# Altium schematic sheet Power_Supply.SchDoc: Power Supply
size A4; DrawnBy: Tomáš Polišenský; DocumentNumber: 1; Revision: A; SheetNumber: 1; SheetTotal: 8; ProjectName: DykoDAC2
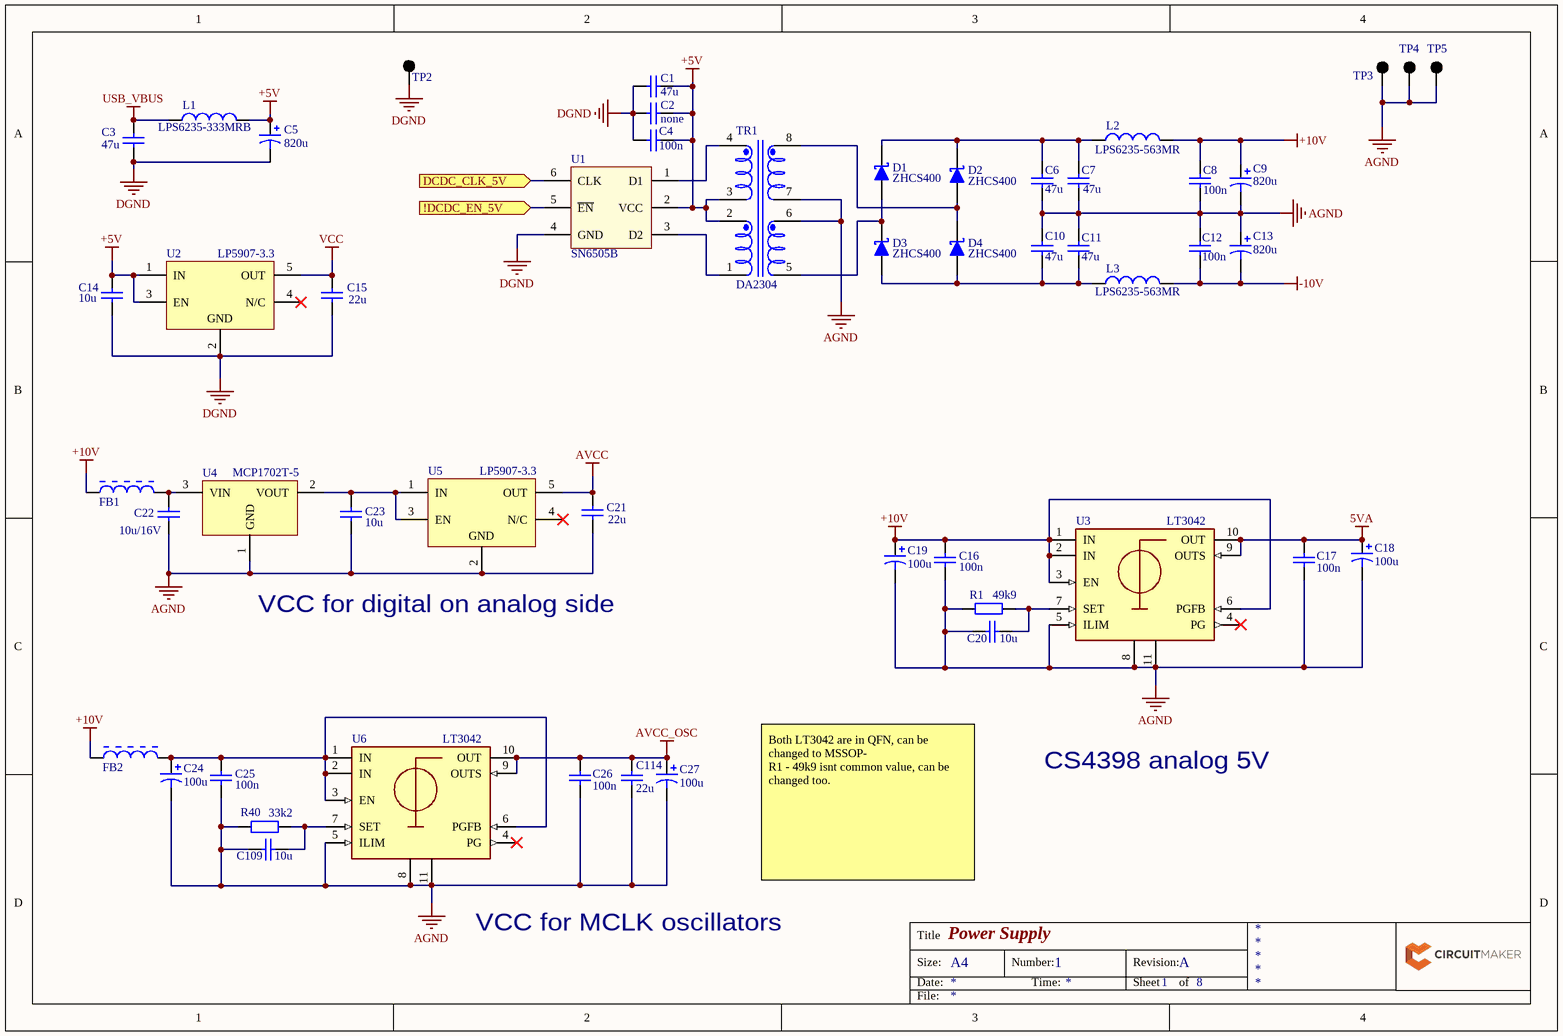
[diagram p0: Power_Supply.SchDoc]

## Parts
C1  47u  [PCB-6alau6k4isvsg1wxu4va-1]
C2  none  [PCB-6alau6k4isvsg1wxu4va-1]
C3  47u  [PCB-6alau6k4isvsg1wxu4va-1]
C4  100n  [PCB-rf0pzaa82dpbeu9l4sxm-1]
C5  820u  [A750MS827M1CAAE013]
C6  47u  [PCB-6alau6k4isvsg1wxu4va-1]
C7  47u  [PCB-6alau6k4isvsg1wxu4va-1]
C8  100n  [PCB-rf0pzaa82dpbeu9l4sxm-1]
C9  820u  [A750MS827M1CAAE013]
C10  47u  [PCB-6alau6k4isvsg1wxu4va-1]
C11  47u  [PCB-6alau6k4isvsg1wxu4va-1]
C12  100n  [PCB-rf0pzaa82dpbeu9l4sxm-1]
C13  820u  [A750MS827M1CAAE013]
C14  10u  [PCB-rf0pzaa82dpbeu9l4sxm-1]
C15  22u  [PCB-rf0pzaa82dpbeu9l4sxm-1]
C16  100n  [PCB-rf0pzaa82dpbeu9l4sxm-1]
C17  100n  [PCB-rf0pzaa82dpbeu9l4sxm-1]
C18  100u  [PCB-9bfrndi9huxo1n7cihpl-1]
C19  100u  [PCB-9bfrndi9huxo1n7cihpl-1]
C20  10u  [PCB-rf0pzaa82dpbeu9l4sxm-1]
C21  22u  [PCB-rf0pzaa82dpbeu9l4sxm-1]
C22  10u/16V  [PCB-rf0pzaa82dpbeu9l4sxm-1]
C23  10u  [PCB-rf0pzaa82dpbeu9l4sxm-1]
C24  100u  [PCB-9bfrndi9huxo1n7cihpl-1]
C25  100n  [PCB-rf0pzaa82dpbeu9l4sxm-1]
C26  100n  [PCB-rf0pzaa82dpbeu9l4sxm-1]
C27  100u  [PCB-9bfrndi9huxo1n7cihpl-1]
C109  10u  [PCB-rf0pzaa82dpbeu9l4sxm-1]
C114  22u  [PCB-rf0pzaa82dpbeu9l4sxm-1]
D1  ZHCS400  [PCB-mrclmtn06znaca5ywvvw-1]
D2  ZHCS400  [PCB-mrclmtn06znaca5ywvvw-1]
D3  ZHCS400  [PCB-mrclmtn06znaca5ywvvw-1]
D4  ZHCS400  [PCB-mrclmtn06znaca5ywvvw-1]
FB1  BLM18EG391TN1D  [MURA-BLM18-F-H3-CHIP-2_V]  (value not drawn)
FB2  BLM18EG391TN1D  [MURA-BLM18-F-H3-CHIP-2_V]  (value not drawn)
L1  LPS6235-333MRB  [LPS6235]
L2  LPS6235-563MR  [PCB-91apuy3syfgd6vk6qbo6-1]
L3  LPS6235-563MR  [PCB-91apuy3syfgd6vk6qbo6-1]
R1  49k9  [PCB-3d5y3t7f8drf35yjcj59-1]
R40  33k2  [PCB-3d5y3t7f8drf35yjcj59-1]
TP2  Keystone Electronics 5001  [P1-09]  (value not drawn)
TP3  Keystone Electronics 5001  [P1-09]  (value not drawn)
TP4  Keystone Electronics 5001  [P1-09]  (value not drawn)
TP5  Keystone Electronics 5001  [P1-09]  (value not drawn)
TR1  DA2304  [PCB-wryx25zm61bkpund2vng-1]
U1  SN6505B  [PCB-z49b8x4xdp07datjgpqp-1]
U2  LP5907-3.3  [PCB-ab03it339uw922kmt1cl-1]
U3  LT3042  [PCB-n2zh5wqg9qgt346qmob6-1]
U4  MCP1702T-5  [SOT-23A-CB3_L]
U5  LP5907-3.3  [PCB-ab03it339uw922kmt1cl-1]
U6  LT3042  [PCB-n2zh5wqg9qgt346qmob6-1]

## Ports
!DCDC_EN_5V (in), DCDC_CLK_5V (in)

## Nets
5VA: C17.2 C18.1 U3.9(OUTS) U3.10(OUT)
+5V: C1.1 C2.1 C4.2 C5.1 C14.2 L1.2 TR1.2 TR1.3 U1.2(VCC) U2.1(IN) U2.3(EN)
+10V: C8.2 C9.1 C16.2 C19.1 FB1.1 FB2.1 L2.2 U3.1(IN) U3.2(IN) U3.3(EN) U3.6(PGFB)
-10V: C12.1 C13.2 L3.2
AGND: C6.1 C7.1 C8.1 C9.2 C10.2 C11.2 C12.2 C13.1 C16.1 C17.1 C18.2 C19.2 C20.2 C21.1 C22.1 C23.1 C24.2 C25.1 C26.1 C27.2 C109.2 C114.1 R1.2 R40.2 TP3.1 TP4.1 TP5.1 TR1.6 TR1.7 U3.5(ILIM) U3.8(GND) U3.11(GND) U4.1(GND) U5.2(GND) U6.5(ILIM) U6.8(GND) U6.11(GND)
AVCC: C21.2 U5.5(OUT)
AVCC_OSC: C26.2 C27.1 C114.2 U6.9(OUTS) U6.10(OUT)
DGND: C1.2 C2.2 C3.1 C4.1 C5.2 C14.1 C15.1 TP2.1 U1.4(GND) U2.2(GND)
USB_VBUS: C3.2 L1.1
VCC: C15.2 U2.5(OUT)
!DCDC_EN_5V: U1.5(~{EN}) ; port !DCDC_EN_5V
DCDC_CLK_5V: U1.6(CLK) ; port DCDC_CLK_5V
NetC6_2: C6.2 C7.2 D1.2(K) D2.2(K) L2.1
NetC10_1: C10.1 C11.1 D3.1(A) D4.1(A) L3.1
NetC20_1: C20.1 R1.1 U3.7(SET)
NetC22_2: C22.2 FB1.2 U4.3(VIN)
NetC23_2: C23.2 U4.2(VOUT) U5.1(IN) U5.3(EN)
NetC24_1: C24.1 C25.2 FB2.2 U6.1(IN) U6.2(IN) U6.3(EN) U6.6(PGFB)
NetC109_1: C109.1 R40.1 U6.7(SET)
NetD1_1: D1.1(A) D3.2(K) TR1.5
NetD2_1: D2.1(A) D4.2(K) TR1.8
NetTR1_1: TR1.1 U1.3(D2)
NetTR1_4: TR1.4 U1.1(D1)

Not connected (* = marked no-connect by the designer): U2 4(N/C)*; U3 4(PG)*; U5 4(N/C)*; U6 4(PG)*

## Notes on the sheet
- VCC for digital on analog side
- CS4398 analog 5V
- Both LT3042 are in QFN, can be changed to MSSOP-
  R1 - 49k9 isnt common value, can be changed too.
- (near U6) VCC for MCLK oscillators
- Title
- Size:
- Date:
- A4
- Number:
- Time:
- Revision:
- Sheet
- of
- File:

## Library data of the parts
C1-C3 C6 C7 C10 C11 = CMP-a2006a3718e57dc7-1: 1210 100 uF 16 V ±20% Tolerance X5R SMT Multilayer Ceramic Capacitor; Case/Package: 1210
C4 C8 C12 = CMP-x8hddryxw4o380xfi98v-3: Generic Capacitor 0603; CustomComponentID: x8hddryxw4o380xfi98v; LCSC Part #: C14663
C5 C9 C13 = CMP-1544d833d83eca83-8: Cap Aluminum Polymer 1000uF 16VDC 20% (10 X 12mm) Radial 5mm 0.013 Ohm 5250mA 2000h 105C Bag; Voltage Rating (DC): 16.0 V; Capacitance: 1.00 mF
C14-C17 C20-C23 C25 C26 C109 C114 = CMP-x8hddryxw4o380xfi98v-1: Capacitor 0603; CustomComponentID: x8hddryxw4o380xfi98v
  C14: LCSC Part #: C19702; LCSC Part #: C25804
  C15 C21 C114: LCSC Part #: C59461
  C16 C17 C25 C26: LCSC Part #: C14663
  C20 C23 C109: LCSC Part #: C19702
C18 C19 C24 C27 = CMP-6546a831a81eba81-4: In a Pack of 25, KEMET 100?F Electrolytic Capacitor 10V dc Through Hole - A758EK107M1AAAE016; Capacitance: 100 µF; Equivalent Series Resistance (ESR): 16.0 m?; Voltage Rating (DC): 10.0 V; Capacitance Tolerance: ±20%; Mounting Style: Through Hole; Size-Diameter: 6.30 mm; Size-Height: 8.00 mm; Operating Temperature: 105 °C (max); RoHS: Compliant; Manufacturer Part Number: A758EK107M1AAAE016; Octopart URL: https://octopart.com/a758ek107m1aaae016-kemet-75360318; OctopartID: 6546a831a81eba81
D1-D4 = CMP-3796931-5: Schottky Rectifier, 0.4A, 40V SOD-323; Power Rating: 250 mW; REACH SVHC Compliance: No SVHC; Packaging: Cut Tape (CT); Octopart URL: https://octopart.com/zhcs400-diodes+inc.-13152663; Case/Package: SOD-323; Lifecycle Status: Active; RoHS: Compliant; OctopartID: 21c3e801b532fe04; Manufacturer Part Number: ZHCS400
FB1 FB2 = CMP-1144711-3: Chip Ferrite Bead for GHz Band General Use (Low DC Resistance Type), 390 Ohm, 500 mA, -55 to 125 degC, 1.6 x 0.8 x 0.65 mm SMD, Tape and Reel; Lead-Free Status: Lead Free; Number of Circuits: 1; Resistance: 390.0 Ω; Shielding: No; Manufacturer Part Number: BLM18EG391TN1D; Case/Package: 0603; Mounting Style: Surface Mount; Number of Pins: 2; Octopart Url: https://octopart.com/blm18eg391tn1d-murata-894703; OctopartID: 5b48924fd8c1848f; Packaging: Cut Tape (CT); REACH SVHC Compliance: No SVHC; RoHS: Compliant; Size-Length: 0.0016 m; Size-Width: 0.0008 m
L1 = CMP-f5873d4763982a40-2: Power inductor, shielded, 20% tol, SMT, RoHS, lead-free, halogen-free
L2 L3 = CMP-db2813e84dcb04ef-1: Power inductor, shielded, 20% tol, SMT, RoHS, lead-free, halogen-free; Inductance: 56.0 µH; REACH SVHC Compliance: No SVHC; Packaging: Cut Tape (CT); Lifecycle Status: Active
R1 R40 = CMP-xcu3s4ikiffkkgbeyow5-1: Resistor 0603; CustomComponentID: xcu3s4ikiffkkgbeyow5
TP2-TP5 = CMP-954154-31: KEYSTONE   5001   TEST POINT, PCB, THROUGH HOLE
TR1 = CMP-7cc7b5ab862da300-5: Transformer, for ADM2485, 5-6V, SMT, RoHS; Manufacturer Part Number: DA2303-ALB; Lead-Free Status: Contains Lead; Lifecycle Status: Active; Mounting Style: Surface Mount; OctopartID: 7cc7b5ab862da300; RoHS: Compliant; Octopart URL: https://octopart.com/da2303-alb-coilcraft-6741900
U1 = CMP-a28c686de0427d4b-3: Low-Noise 1 A, 420 kHz Transformer Driver 6-SOT-23 -55 to 125; Manufacturer Part Number: SN6505BDBVT; Lead-Free Status: Lead Free; RoHS: Compliant; Packaging: Cut Tape (CT); Number of Pins: 6; Lifecycle Status: Active; Case/Package: SOT-23; Octopart URL: http://octopart.com/sn6505bdbvr-texas+instruments-65759143; OctopartID: 65ebaf0a272aba2c
U2 U5 = CMP-9de05591815b4227-2: 250mA Ultralow-Noise Low-IQ LDO 4-DSBGA -40 to 125; Manufacturer Part Number: LP5907UVX-3.3/NOPB; Number of Regulated Outputs: 1; Quiescent Current: 12.0 µA; Dropout Voltage: 50.0 mV; Lead-Free Status: Lead Free; Output Capacitor Type: Ceramic; Thermal Shutdown: Yes; RoHS: Compliant; OctopartID: 9de05591815b4227; Octopart URL: http://octopart.com/lp5907uvx-3.3%2Fnopb-texas+instruments-24852957; Lifecycle Status: Active; Packaging: Cut Tape (CT); Mounting Style: Surface Mount
U3 U6 = CMP-ff8235e0d3752045-3: LT3042 - 20V, 200mA, Ultralow Noise, Ultrahigh PSRR RF Linear Regulator; Manufacturer Part Number: LT3042EDD#PBF; Output Voltage: 0.00 V (min), 15.0 V (max); OctopartID: ff8235e0d3752045; Output Current: 200 mA; REACH SVHC Compliance: No SVHC; Octopart URL: http://octopart.com/lt3042edd%23pbf-linear+technology-57149841; RoHS: Compliant; Case/Package: DFN; Number of Pins: 10
U4 = CMP-1493251-3: 250 mA Low Quiescent Current LDO Regulator, 3-Pin SOT-23A, Extended Temperature, Tape and Reel; Manufacturer Part Number: MCP1702T-5002E/CB; Dropout Voltage: 0.625 V; Lead-Free Status: Lead Free; Number of Outputs: 1; Output Voltage: 5.0 V; Quiescent Current: 2e-06 A; Lifecycle Status: Active; Mounting Style: Surface Mount; Number of Pins: 3; Octopart Url: https://octopart.com/mcp1702t-5002e%2Fcb-microchip-535771; OctopartID: c0f809fac9451f3f; Packaging: Tape & Reel (TR); REACH SVHC Compliance: No SVHC; RoHS: Compliant